# EAGLE design wd-switch (EAGLE 6.5.0)
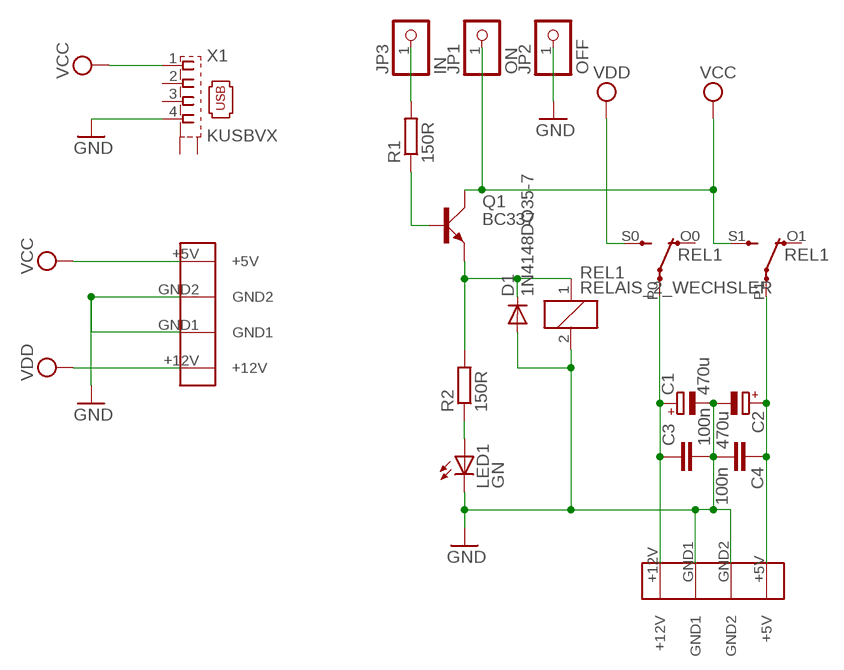
[diagram p0: schematic, sheet 1]

## Parts
C1  470u  CPOL-EUE3.5-8  [E3,5-8]
C2  470u  CPOL-EUE3.5-8  [E3,5-8]
C3  100n  C-EU025-024X044  [C025-024X044]
C4  100n  C-EU025-024X044  [C025-024X044]
D1  1N4148DO35-7  [DO35-7]
IN  PSW_5  [PSW_5]
JP1  ON  PINHD-1X1  [1X01]
JP2  OFF  PINHD-1X1  [1X01]
JP3  IN  PINHD-1X1  [1X01]
LED1  GN  LED5MM  [LED5MM]
OUT  PSW_5  [PSW_5]
Q1  BC337  [SOT54A]
R1  150R  R-EU_0207/2V  [0207/2V]
R2  150R  R-EU_0207/7  [0207/7]
REL1  RELAIS_2_WECHSLER  [RELAIS_DIL_M4]
X1  KUSBVX  [KUSBVX]

## Nets
GND: C1.- C2.- C3.2 C4.2 D1.A IN.GND1 IN.GND2 JP2.1 LED1.K(C) OUT.GND1 OUT.GND2 REL1.2 X1.4
N$1: JP3.1 R1.2
N$2: C1.+ C3.1 OUT.+12V REL1.P0(W1:P)
N$3: Q1.B R1.1
N$4: C2.+ C4.1 OUT.+5V REL1.P1(W2:P)
N$7: LED1.A R2.1
N$11: D1.C Q1.E R2.2 REL1.1
VCC: IN.+5V JP1.1 Q1.C REL1.S1(W2:S) X1.1
VDD: IN.+12V REL1.S0(W1:S)
Unconnected: REL1.O0(W1:O) REL1.O1(W2:O) X1.2 X1.3 X1.M1(S1) X1.M2(S2)

## Library data of the parts
C1 C2 = resistor:CPOL-EU: POLARIZED CAPACITOR, European symbol
C3 C4 = resistor:C-EU: CAPACITOR, European symbol
D1 = diode:1N4148: DIODE high speed (Philips)
IN OUT = n39:PSW_5: PSW 5 Stromversorgungsstecker f. 5 1/4 Zoll, Print, gew. http://www.reichelt.de/?ARTICLE=14915
JP1-JP3 = pinhead:PINHD-1X1: PIN HEADER
LED1 = led:LED: LED OSRAM: - CHIPLED LG R971, LG N971, LY N971, LG Q971, LY Q971, LO R971, LY R971 LH N974, LH R974 LS Q976, LO Q976, LY Q976 LO Q996 - Hyper CHIPLED LW Q18S LB Q993, LB Q99A, LB R99A - SideLED LS A670, LO A670, LY A670, LG A670, LP A670 LB A673, LV A673, LT A673, LW A673 LH A674 LY A675 LS A676, LA A676, LO A676, LY A676, LW A676 LS A679, LY A679, LG A679 - Hyper Micro SIDELED® LS Y876, LA Y876, LO Y876, LY Y876 LT Y87S - SmartLED LW L88C, LW L88S LB L89C, LB L89S, LG L890 LS L89K, LO L89K, LY L89K LS L896, LA L896, LO L896, LY L896 - TOPLED LS T670, LO T670, LY T670, LG T670, LP T670 LSG T670, LSP T670, LSY T670, LOP T670, LYG T670 LG T671, LOG T671, LSG T671 LB T673, LV T673, LT T673, LW T673 LH T674 LS T676, LA T676, LO T676, LY T676, LB T676, LH T676, LSB T676, LW T676 LB T67C, LV T67C, LT T67C, LS T67K, LO T67K, LY T67K, LW E67C LS E67B, LA E67B, LO E67B, LY E67B, LB E67C, LV E67C, LT E67C LW T67C LS T679, LY T679, LG T679 LS T770, LO T770, LY T770, LG T770, LP T770 LB T773, LV T773, LT T773, LW T773 LH T774 LS E675, LA E675, LY E675, LS T675 LS T776, LA T776, LO T776, LY T776, LB T776 LHGB T686 LT T68C, LB T68C - Hyper Mini TOPLED® LB M676 - Mini TOPLED Santana® LG M470 LS M47K, LO M47K, LY M47K Source: http://www.osram.convergy.de LUXEON: - LUMILED® LXK2-PW12-R00, LXK2-PW12-S00, LXK2-PW14-U00, LXK2-PW14-V00 LXK2-PM12-R00, LXK2-PM12-S00, LXK2-PM14-U00 LXK2-PE12-Q00, LXK2-PE12-R00, LXK2-PE12-S00, LXK2-PE14-T00, LXK2-PE14-U00 LXK2-PB12-K00, LXK2-PB12-L00, LXK2-PB12-M00, LXK2-PB14-N00, LXK2-PB14-P00, LXK2-PB14-Q00 LXK2-PR12-L00, LXK2-PR12-M00, LXK2-PR14-Q00, LXK2-PR14-R00 LXK2-PD12-Q00, LXK2-PD12-R00, LXK2-PD12-S00 LXK2-PH12-R00, LXK2-PH12-S00 LXK2-PL12-P00, LXK2-PL12-Q00, LXK2-PL12-R00 Source: www.luxeon.com KINGBRIGHT: KA-3528ASYC Source: www.kingbright.com
Q1 = transistor-small-signal:BC337: NPN TRANSISTOR
R1 R2 = resistor:R-EU_: RESISTOR, European symbol
REL1 = n39:RELAIS_2_WECHSLER: 2-fach Wechsel-Relais Packages: M4 5V Spulenspannung (Reichelt M4 05H) Autor: Tux
X1 = con-kycon:KUSBVX: Vertical,Top Entry Universal Serial Bus Connector KUSBVX Series Source: KYCON Sibalco USB vertical socket KUSBV.pdf

## Board
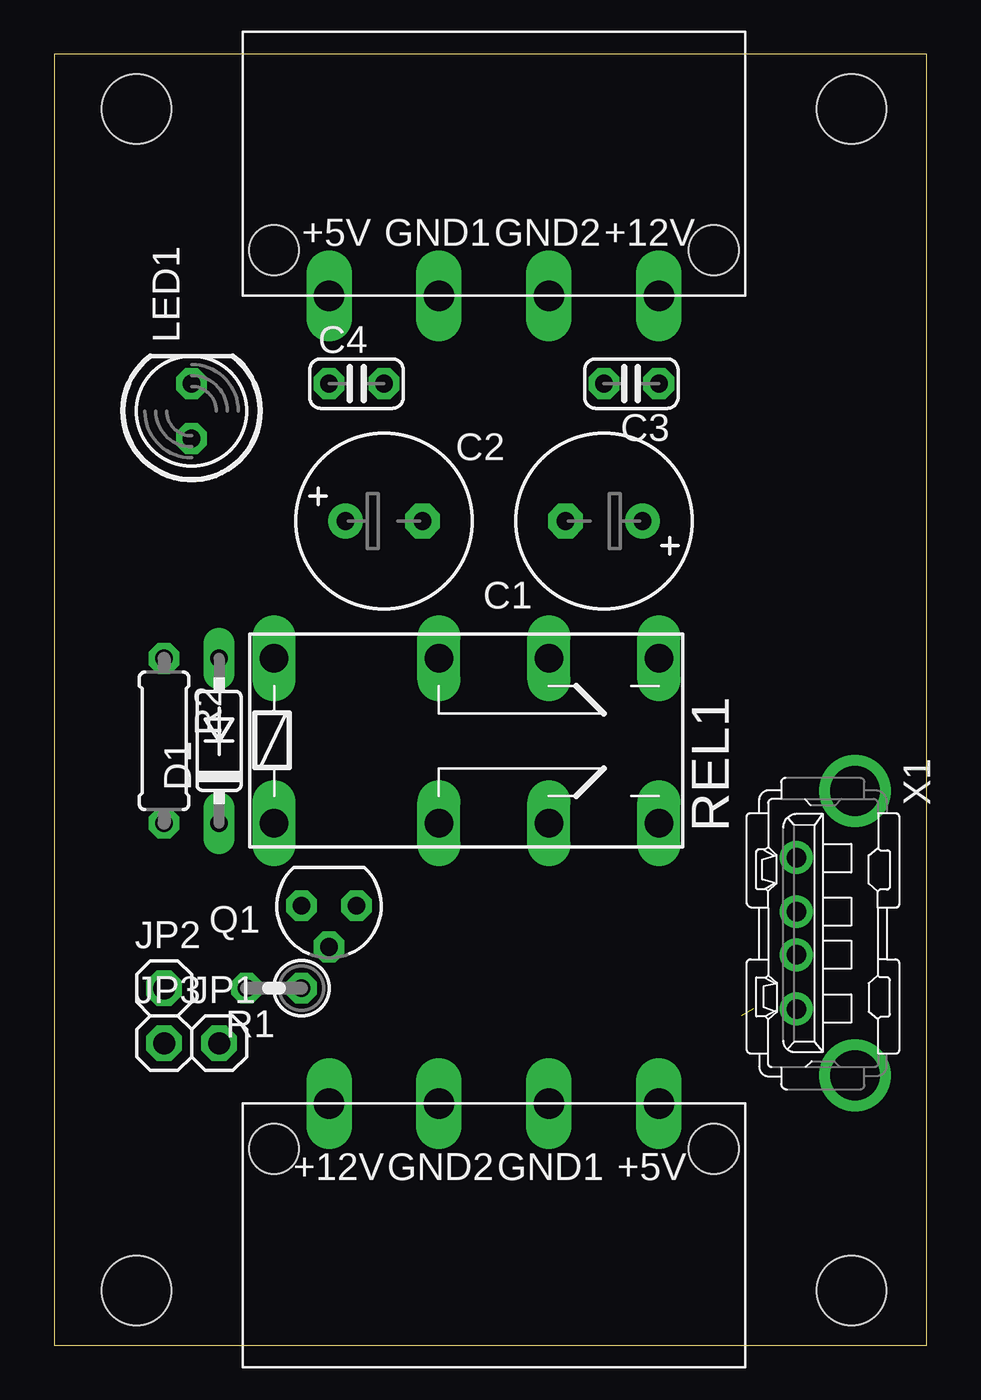
[diagram p1: board, top side]
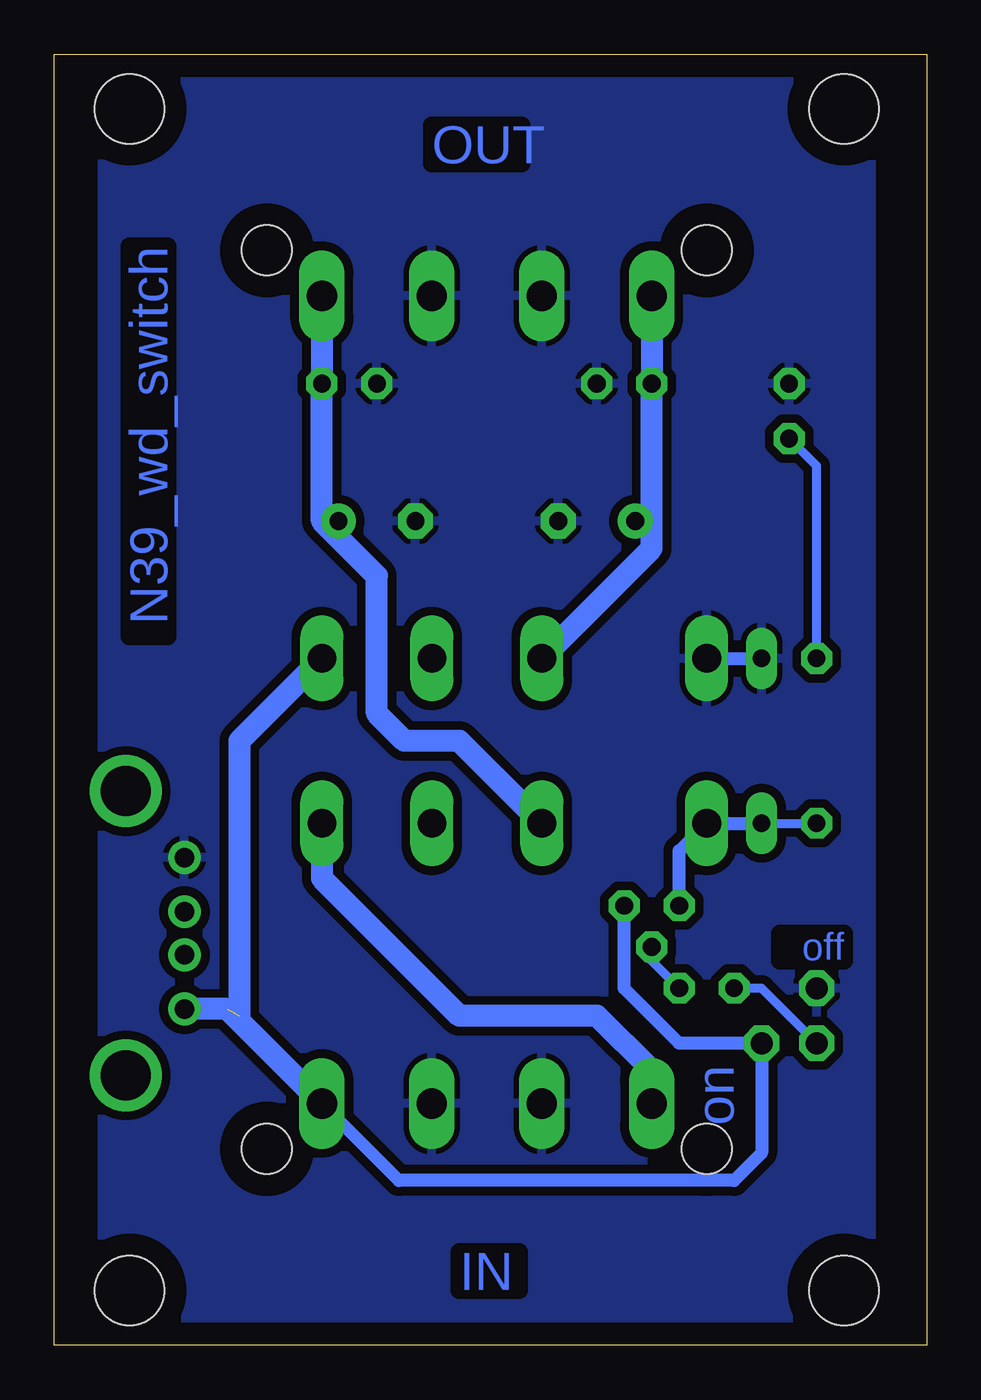
[diagram p2: board, bottom side, seen from below]

Size 40.31 x 59.68 mm. Coordinates in mm from the lower left corner, seen from the top.
Outline: 0,0 40.31,0 40.31,59.68 0,59.68 0,0
Copper layers (1*16): Top 0.035mm / dielectric 1.5mm / Bottom 0.035mm
Design rules "default *": minimum track width 12mil, minimum drill 24mil, track to track 8mil, track to pad 8mil, pad to pad 8mil, via to via 8mil, smd to smd 8mil, copper to edge 40mil, drill to drill 8mil, minimum pad ring 12mil, minimum via ring 12mil, stop-mask expansion 4mil, vias tented up to drill 0mil, thermal gap 10mil
Holes 3.2 mm at 3.81,2.54 36.83,2.54 36.83,57.15 3.81,57.15

### Footprints (pad centres in the part's own frame; a part is rotated, then mirrored left to right if it is on the bottom)
E3,5-8 = drill 0.813 pad 1.6: + -1.778,0 | drill 0.813 pad 1.6 octagon: - 1.778,0
C025-024X044 = drill 0.813 octagon: 1 -1.27,0; 2 1.27,0
DO35-7 = drill 0.813 long: A 3.81,0; C -3.81,0
PSW_5 = drill 1.4 long: +5V -7.62,-6.1; +12V 7.62,-6.1; GND1 -2.54,-6.1; GND2 2.54,-6.1 | hole 2.3: -10.16,-4; 10.16,-4
1X01 = drill 1.016 octagon: 1 0,0
LED5MM = drill 0.813 octagon: A -1.27,0; K 1.27,0
SOT54A = drill 0.813 octagon: B 0,1.905; C -1.27,0; E 1.27,0
0207/2V = drill 0.813 octagon: 1 -1.27,0; 2 1.27,0
0207/7 = drill 0.813 octagon: 1 -3.81,0; 2 3.81,0
RELAIS_DIL_M4 = drill 1.321 long: 1 -7.62,-2.54; 2 -7.62,5.08; O0 5.08,-2.54; O1 5.08,5.08; P0 0,-2.54; P1 0,5.08; S0 10.16,-2.54; S1 10.16,5.08
KUSBVX = drill 0.9 pad 1.3: 1 3.5,0; 2 1,0; 3 -1,0; 4 -3.5,0 | drill 2.3 pad 2.8: M1 -6.57,2.71; M2 6.57,2.71

### Placement (x,y rotation side)
C1  25.4,38.1 180 top
C2  15.24,38.1 0 top
C3  26.67,44.45 180 top
C4  13.97,44.45 0 top
D1  7.62,27.94 90 top
IN  20.32,5.08 180 top
JP1  7.62,13.97 0 top
JP2  5.08,16.51 0 top
JP3  5.08,13.97 0 top
LED1  6.35,43.18 90 top
OUT  20.32,54.61 0 top
Q1  12.7,20.32 180 top
R1  10.16,16.51 180 top
R2  5.08,27.94 270 top
REL1  17.78,26.67 0 top
X1  34.29,19.05 270 top

### Tracks (layer width: path | path; a pad name or v marks a point on that pad's centre or on a via)
GND
  Bottom 0.61: REL1.2 D1.A
  pour Bottom (isolate 0.406): 2.54,58.42 38.1,58.42 38.1,1.27 2.54,1.27
N$1
  Bottom 0.406: JP3.1 7.62,16.51 R1.2
N$2
  Bottom 1.016: OUT.+12V C3.1 27.94,38.1 | REL1.P0 21.59,27.94 24.13,27.94 25.4,29.21 25.4,35.56 27.94,38.1 | C1.+ 27.94,38.1
N$3
  Bottom 0.406: R1.1 12.7,17.78 Q1.B
N$4
  Bottom 1.016: OUT.+5V C4.1 12.7,38.1 | REL1.P1 12.7,36.83 12.7,38.1 | C2.+ 12.7,38.1
N$7
  Bottom 0.406: R2.1 5.08,40.64 LED1.A
N$11
  Bottom 0.406: D1.C R2.2
  Bottom 0.61: Q1.E 11.43,22.86 REL1.1 D1.C
VCC  (1 unrouted)
  Bottom 0.61: IN.+5V 24.38,7.62 8.89,7.62 7.62,8.89 JP1.1 11.43,13.97 13.97,16.51 Q1.C
  Bottom 1.016: IN.+5V 32.31,15.55 X1.1 | REL1.S1 31.75,27.94 31.75,15.24
VDD
  Bottom 1.016: IN.+12V 12.7,12.7 15.24,15.24 21.59,15.24 27.94,21.59 REL1.S0

### Text on the board
Bottom: OUT | N39_wd_switch | off | on | IN